# Altium schematic sheet Sheet3.SchDoc
size A4
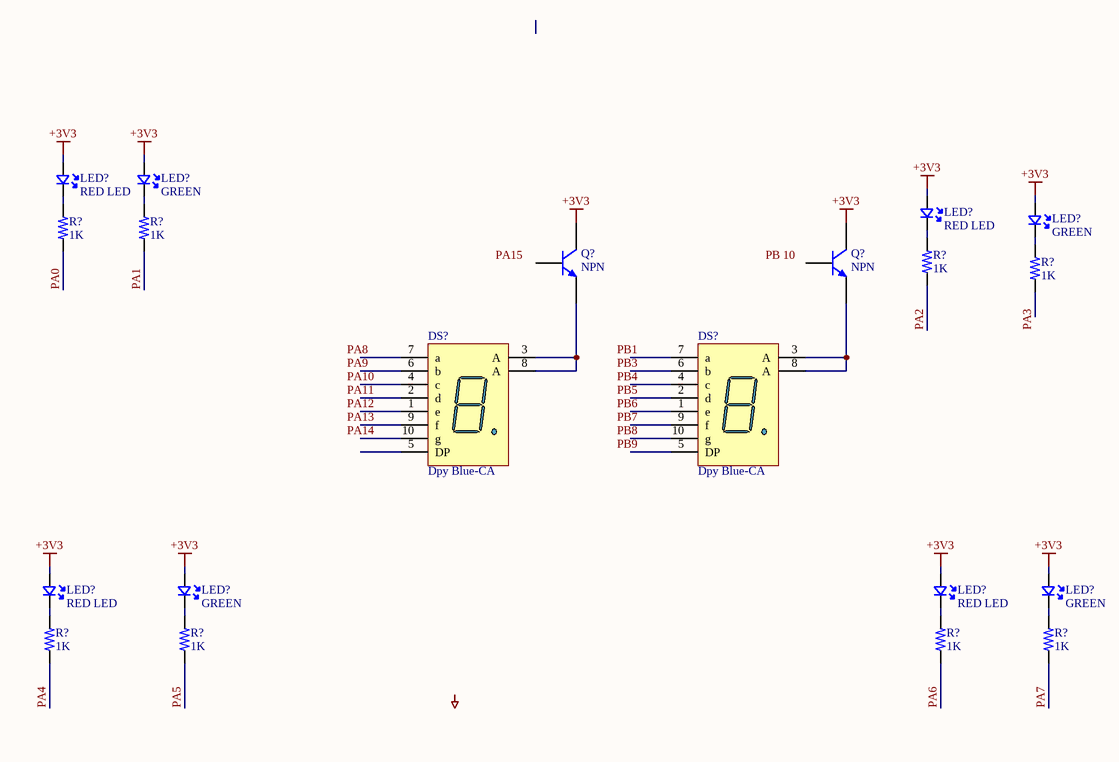
[diagram p0: Sheet3.SchDoc]

## Parts
(Parts that share a designator on the sheet are numbered #1, #2 ... from top to bottom, then left to right.)
DS?#1  Dpy Blue-CA  [H]
DS?#2  Dpy Blue-CA  [H]
LED?#1  RED LED  [LED_0805]
LED?#2  GREEN  [LED_0805]
LED?#3  RED LED  [LED_0805]
LED?#4  GREEN  [LED_0805]
LED?#5  RED LED  [LED_0805]
LED?#6  GREEN  [LED_0805]
LED?#7  RED LED  [LED_0805]
LED?#8  GREEN  [LED_0805]
Q?#1  NPN  [TO-226-AA]
Q?#2  NPN  [TO-226-AA]
R?#1  1K  [RES_0805]
R?#2  1K  [RES_0805]
R?#3  1K  [RES_0805]
R?#4  1K  [RES_0805]
R?#5  1K  [RES_0805]
R?#6  1K  [RES_0805]
R?#7  1K  [RES_0805]
R?#8  1K  [RES_0805]

## Nets
+3V3: LED?#1.A LED?#2.A LED?#3.A LED?#4.A LED?#5.A LED?#6.A LED?#7.A LED?#8.A Q?#1.1(C) Q?#2.1(C)
PA0: R?#1.1
PA1: R?#2.1
PA2: R?#3.1
PA4: R?#5.1
PA5: R?#6.1
PA6: R?#7.1
PA7: R?#8.1
NetDS?#1_3: DS?#1.3(A) DS?#1.8(A) Q?#1.3(E)
NetDS?#2_3: DS?#2.3(A) DS?#2.8(A) Q?#2.3(E)
NetLED?#1_K: LED?#1.K R?#1.2
NetLED?#2_K: LED?#2.K R?#2.2
NetLED?#3_K: LED?#3.K R?#3.2
NetLED?#4_K: LED?#4.K R?#4.2
NetLED?#5_K: LED?#5.K R?#5.2
NetLED?#6_K: LED?#6.K R?#6.2
NetLED?#7_K: LED?#7.K R?#7.2
NetLED?#8_K: LED?#8.K R?#8.2

Not connected (* = marked no-connect by the designer): DS?#1 1(e) 2(d) 4(c) 5(DP) 6(b) 7(a) 9(f) 10(g); DS?#2 1(e) 2(d) 4(c) 5(DP) 6(b) 7(a) 9(f) 10(g); Q?#1 2(B); Q?#2 2(B); R?#4 1

## Notes on the sheet
- Labels drawn without touching a wire or pin: PA3, PA8, PA9, PA10, PA11, PA12, PA13, PA14, PA15, PB1, PB3, PB4, PB5, PB6, PB7, PB8, PB9, PB 10

## Library data of the parts
DS?#1 DS?#2 = Dpy Blue-CA: 14.2 mm General Purpose Blue 7-Segment Display: CA, RH DP, Gray Surface; MinimumIntensity: 2020 ucd; Note: IF = 10 mA; Published: 8-Jun-2000; LatestRevisionDate: 17-Dec-2003; LatestRevisionNote: Schematic revised, PCB Footprint replaced.; DatasheetVersion: 24-Sep-2002; PackageVersion: 24-Sep-2002; PackageReference: H; Publisher: Altium Limited; PackageDescription: LED, 7-Segment Display, 14.2 mm, RHD; 10 Leads; Row Space 15.24 mm; Pitch 2.54 mm; Colour: Blue; ComponentLink1Description: Manufacturer Link; ComponentLink1URL: http://www.agilent.com/
LED?#1-LED?#8 = LED-RED_10mA-0805: Red 621nm LED Indication - Discrete 2V 0805 (2012 Metric); Manufacturer: Lite-On Inc.; Manufacturer Part Number: LTST-C170EKT; Case/ Package: 0805; Supplier-1: Digikey; Supplier Part Number-1: 160-1178-1-ND
Q?#1 Q?#2 = NPN: NPN Bipolar Transistor; Published: 8-Jun-2000; LatestRevisionDate: 17-Jul-2002; LatestRevisionNote: Re-released for DXP Platform.; PackageReference: TO-226-AA; Publisher: Altium Limited; PackageDescription: TO, Flat Index; 3 In-Line, Axial Leads; Body Dia. 4.8mm; Leads 0.55 x 0.51 mm (max); Code_JEDEC: TO-226-AA
R?#1-R?#8 = RES_1K-0.125W-1%-0805: 1 kOhms ±1% 0.125W, 1/8W Chip Resistor 0805 (2012 Metric) Moisture Resistant Thick Film; Manufacturer: 垈㎵á; Manufacturer Part Number: RC0805FR-071KL; Case/Package: 0805; Supplier-1: Digikey; Supplier Part Number-1: 311-1.00KCRCT-ND